# Altium schematic sheet Teensy3.SchDoc
size A4
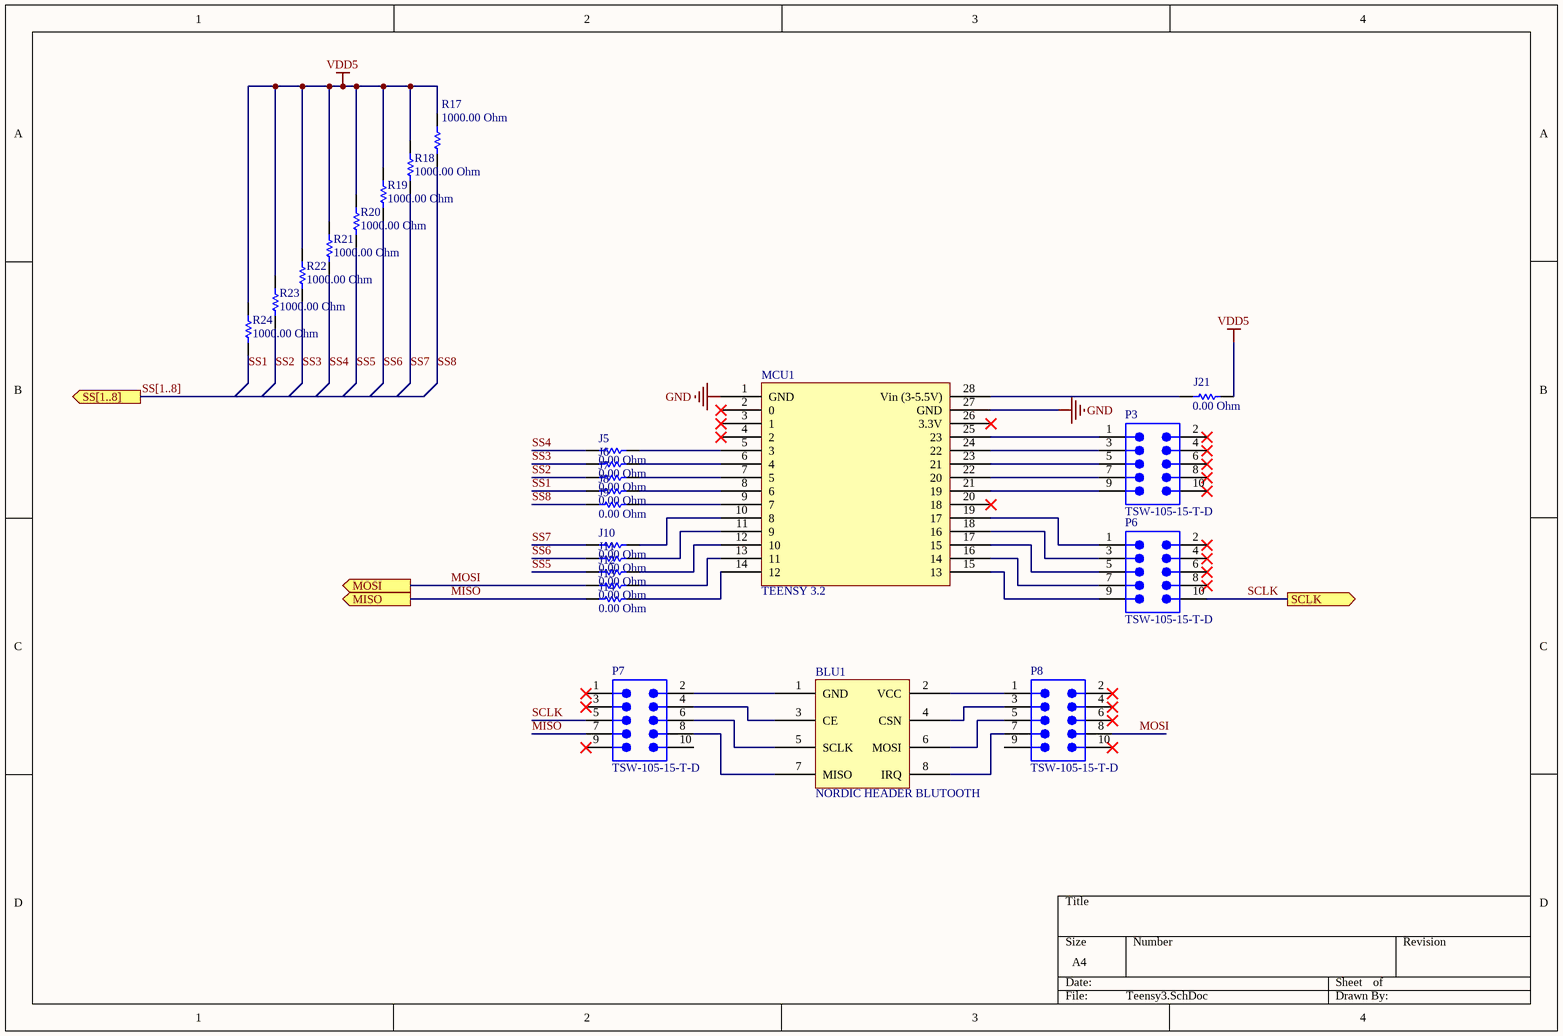
[diagram p0: Teensy3.SchDoc]

## Parts
BLU1  NORDIC HEADER BLUTOOTH  [NORDIC BLUTOOTH HEADER]
J5  0.00 Ohm  [RESC1206(3216)_M]
J6  0.00 Ohm  [RESC1206(3216)_M]
J7  0.00 Ohm  [RESC1206(3216)_M]
J8  0.00 Ohm  [RESC1206(3216)_M]
J9  0.00 Ohm  [RESC1206(3216)_M]
J10  0.00 Ohm  [RESC1206(3216)_M]
J11  0.00 Ohm  [RESC1206(3216)_M]
J12  0.00 Ohm  [RESC1206(3216)_M]
J13  0.00 Ohm  [RESC1206(3216)_M]
J14  0.00 Ohm  [RESC1206(3216)_M]
J21  0.00 Ohm  [RESC1206(3216)_M]
MCU1  TEENSY 3.2  [TEENSY 3.1]
P3  TSW-105-15-T-D  [SMTC-TSW-105-15-X-D]
P6  TSW-105-15-T-D  [SMTC-TSW-105-15-X-D]
P7  TSW-105-15-T-D  [SMTC-TSW-105-15-X-D]
P8  TSW-105-15-T-D  [SMTC-TSW-105-15-X-D]
R17  value 1000.00 Ohm  [RESC0603(1608)_L]  (hidden comment: 1K 5% 0603(1608))
R18  value 1000.00 Ohm  [RESC0603(1608)_L]  (hidden comment: 1K 5% 0603(1608))
R19  value 1000.00 Ohm  [RESC0603(1608)_L]  (hidden comment: 1K 5% 0603(1608))
R20  value 1000.00 Ohm  [RESC0603(1608)_L]  (hidden comment: 1K 5% 0603(1608))
R21  value 1000.00 Ohm  [RESC0603(1608)_L]  (hidden comment: 1K 5% 0603(1608))
R22  value 1000.00 Ohm  [RESC0603(1608)_L]  (hidden comment: 1K 5% 0603(1608))
R23  value 1000.00 Ohm  [RESC0603(1608)_L]  (hidden comment: 1K 5% 0603(1608))
R24  value 1000.00 Ohm  [RESC0603(1608)_L]  (hidden comment: 1K 5% 0603(1608))

## Ports
MISO (out), MOSI (out), SCLK (out), SS[1..8] (out)

## Nets
GND: MCU1.1(GND) MCU1.27(GND)
VDD5: J21.2 R17.1 R18.1 R19.1 R20.1 R21.1 R22.1 R23.1 R24.1
MISO: J14.1 P7.7 ; port MISO
MOSI: J13.1 P8.8 ; port MOSI
SCLK: P6.10 P7.5 ; port SCLK
SS1: J8.1 R24.2
SS2: J7.1 R23.2
SS3: J6.1 R22.2
SS4: J5.1 R21.2
SS5: J12.1 R20.2
SS6: J11.1 R19.2
SS7: J10.1 R18.2
SS8: J9.1 R17.2
NetBLU1_1: BLU1.1(GND) P7.2
NetBLU1_2: BLU1.2(VCC) P8.1
NetBLU1_3: BLU1.3(CE) P7.4
NetBLU1_4: BLU1.4(CSN) P8.3
NetBLU1_5: BLU1.5(SCLK) P7.6
NetBLU1_6: BLU1.6(MOSI) P8.5
NetBLU1_7: BLU1.7(MISO) P7.8
NetBLU1_8: BLU1.8(IRQ) P8.7
NetJ5_2: J5.2 MCU1.5(3)
NetJ6_2: J6.2 MCU1.6(4)
NetJ7_2: J7.2 MCU1.7(5)
NetJ8_2: J8.2 MCU1.8(6)
NetJ9_2: J9.2 MCU1.9(7)
NetJ10_2: J10.2 MCU1.10(8)
NetJ11_2: J11.2 MCU1.11(9)
NetJ12_2: J12.2 MCU1.12(10)
NetJ13_2: J13.2 MCU1.13(11)
NetJ14_2: J14.2 MCU1.14(12)
NetJ21_1: J21.1 MCU1.28(Vin_(3-5.5V))
NetMCU1_15: MCU1.15(13) P6.9
NetMCU1_16: MCU1.16(14) P6.7
NetMCU1_17: MCU1.17(15) P6.5
NetMCU1_18: MCU1.18(16) P6.3
NetMCU1_19: MCU1.19(17) P6.1
NetMCU1_21: MCU1.21(19) P3.9
NetMCU1_22: MCU1.22(20) P3.7
NetMCU1_23: MCU1.23(21) P3.5
NetMCU1_24: MCU1.24(22) P3.3
NetMCU1_25: MCU1.25(23) P3.1

Not connected (* = marked no-connect by the designer): MCU1 2(0)* 3(1)* 4(2)* 20(18)* 26(3.3V)*; P3 2* 4* 6* 8* 10*; P6 2* 4* 6* 8*; P7 1* 3* 9* 10; P8 2* 4* 6* 9 10*

## Buses and harness runs
bus SS[1..8] = port SS[1..8]

## Library data of the parts
BLU1 = NORDIC HEADER BLUTOOTH: BLUTOOTH MODULE; Value: 1K; Published: 8-Jun-2000; LatestRevisionDate: 29-May-2009; LatestRevisionNote: IPC-7351 Footprint Added.; PackageReference: J1-0603; Publisher: Altium Limited; PackageDescription: Chip Resistor
J5-J14 J21 = CMP-1014-00001-1: Jumper 1206 (3216 Metric); Tolerance: None; Case-EIA: 1206; Case-Metric: 3216; Technology: SMT; Power: None; Value: 0.00 Ohm; OrderURL: http://www.digikey.ie/product-detail/en/yageo/RC0603JR-070RL/311-0.0GRCT-ND/729622; Supplier 1: Digi-Key; Supplier Part Number 1: 311-0.0GRCT-ND
MCU1 = TEENSY 3.2: MCU; Published: 8-Jun-2000; LatestRevisionDate: 29-May-2009; LatestRevisionNote: IPC-7351 Footprint Added.; PackageReference: J1-0603; Publisher: Altium Limited; PackageDescription: Chip Resistor
P3 P6-P8 = CMP-1024-00368-1: Manufacturer: Samtec; Pitch: 2.54 mm; DatasheetVersion: F-214; PackageDescription: .025[0.64] SQ. Post Terminal Strip Assembly; PartNumber: TSW-105-15-T-D; PackageReference: TSW-105-15-X-D; ComponentLink2URL: http://www.samtec.com/documents/webfiles/pdf/TSW_TH.PDF; ComponentLink1URL: http://www.samtec.com; ComponentLink2Description: Datasheet; ComponentLink3Description: Package Specification; PackageVersion: DM, 8/1988; Mounting Technology: Through-hole; Temperature Range: -55 to 105 degC; ComponentLink1Description: Manufacturer URL; RoHS: True; ComponentLink3URL: http://www.samtec.com/documents/webfiles/cpdf/TSW-XXX-XX-XXX-X-XX-XXX-MKT.pdf; Orientation: Vertical
R17-R24 = CMP-1012-00074-1: 1K 0.1W 5% 0603 (1608 Metric)  SMD; Case-EIA: 0603; Case-Metric: 1608; Technology: SMT; Tolerance: 5 %; Power: 0.1 W; OrderURL: http://www.digikey.ie/product-detail/en/yageo/RC0603JR-071KL/311-1.0KGRCT-ND/729624; Supplier 1: Digi-Key; Supplier Part Number 1: 311-1.0KGRCT-ND